# EasyEDA schematic 1-Schematic_charger.json
TITLE: Sheet_1; REV: 1.0; Date: 2021-10-08; Sheet: 1/1; Drawn By: Amith bhat D; Company: Your Company
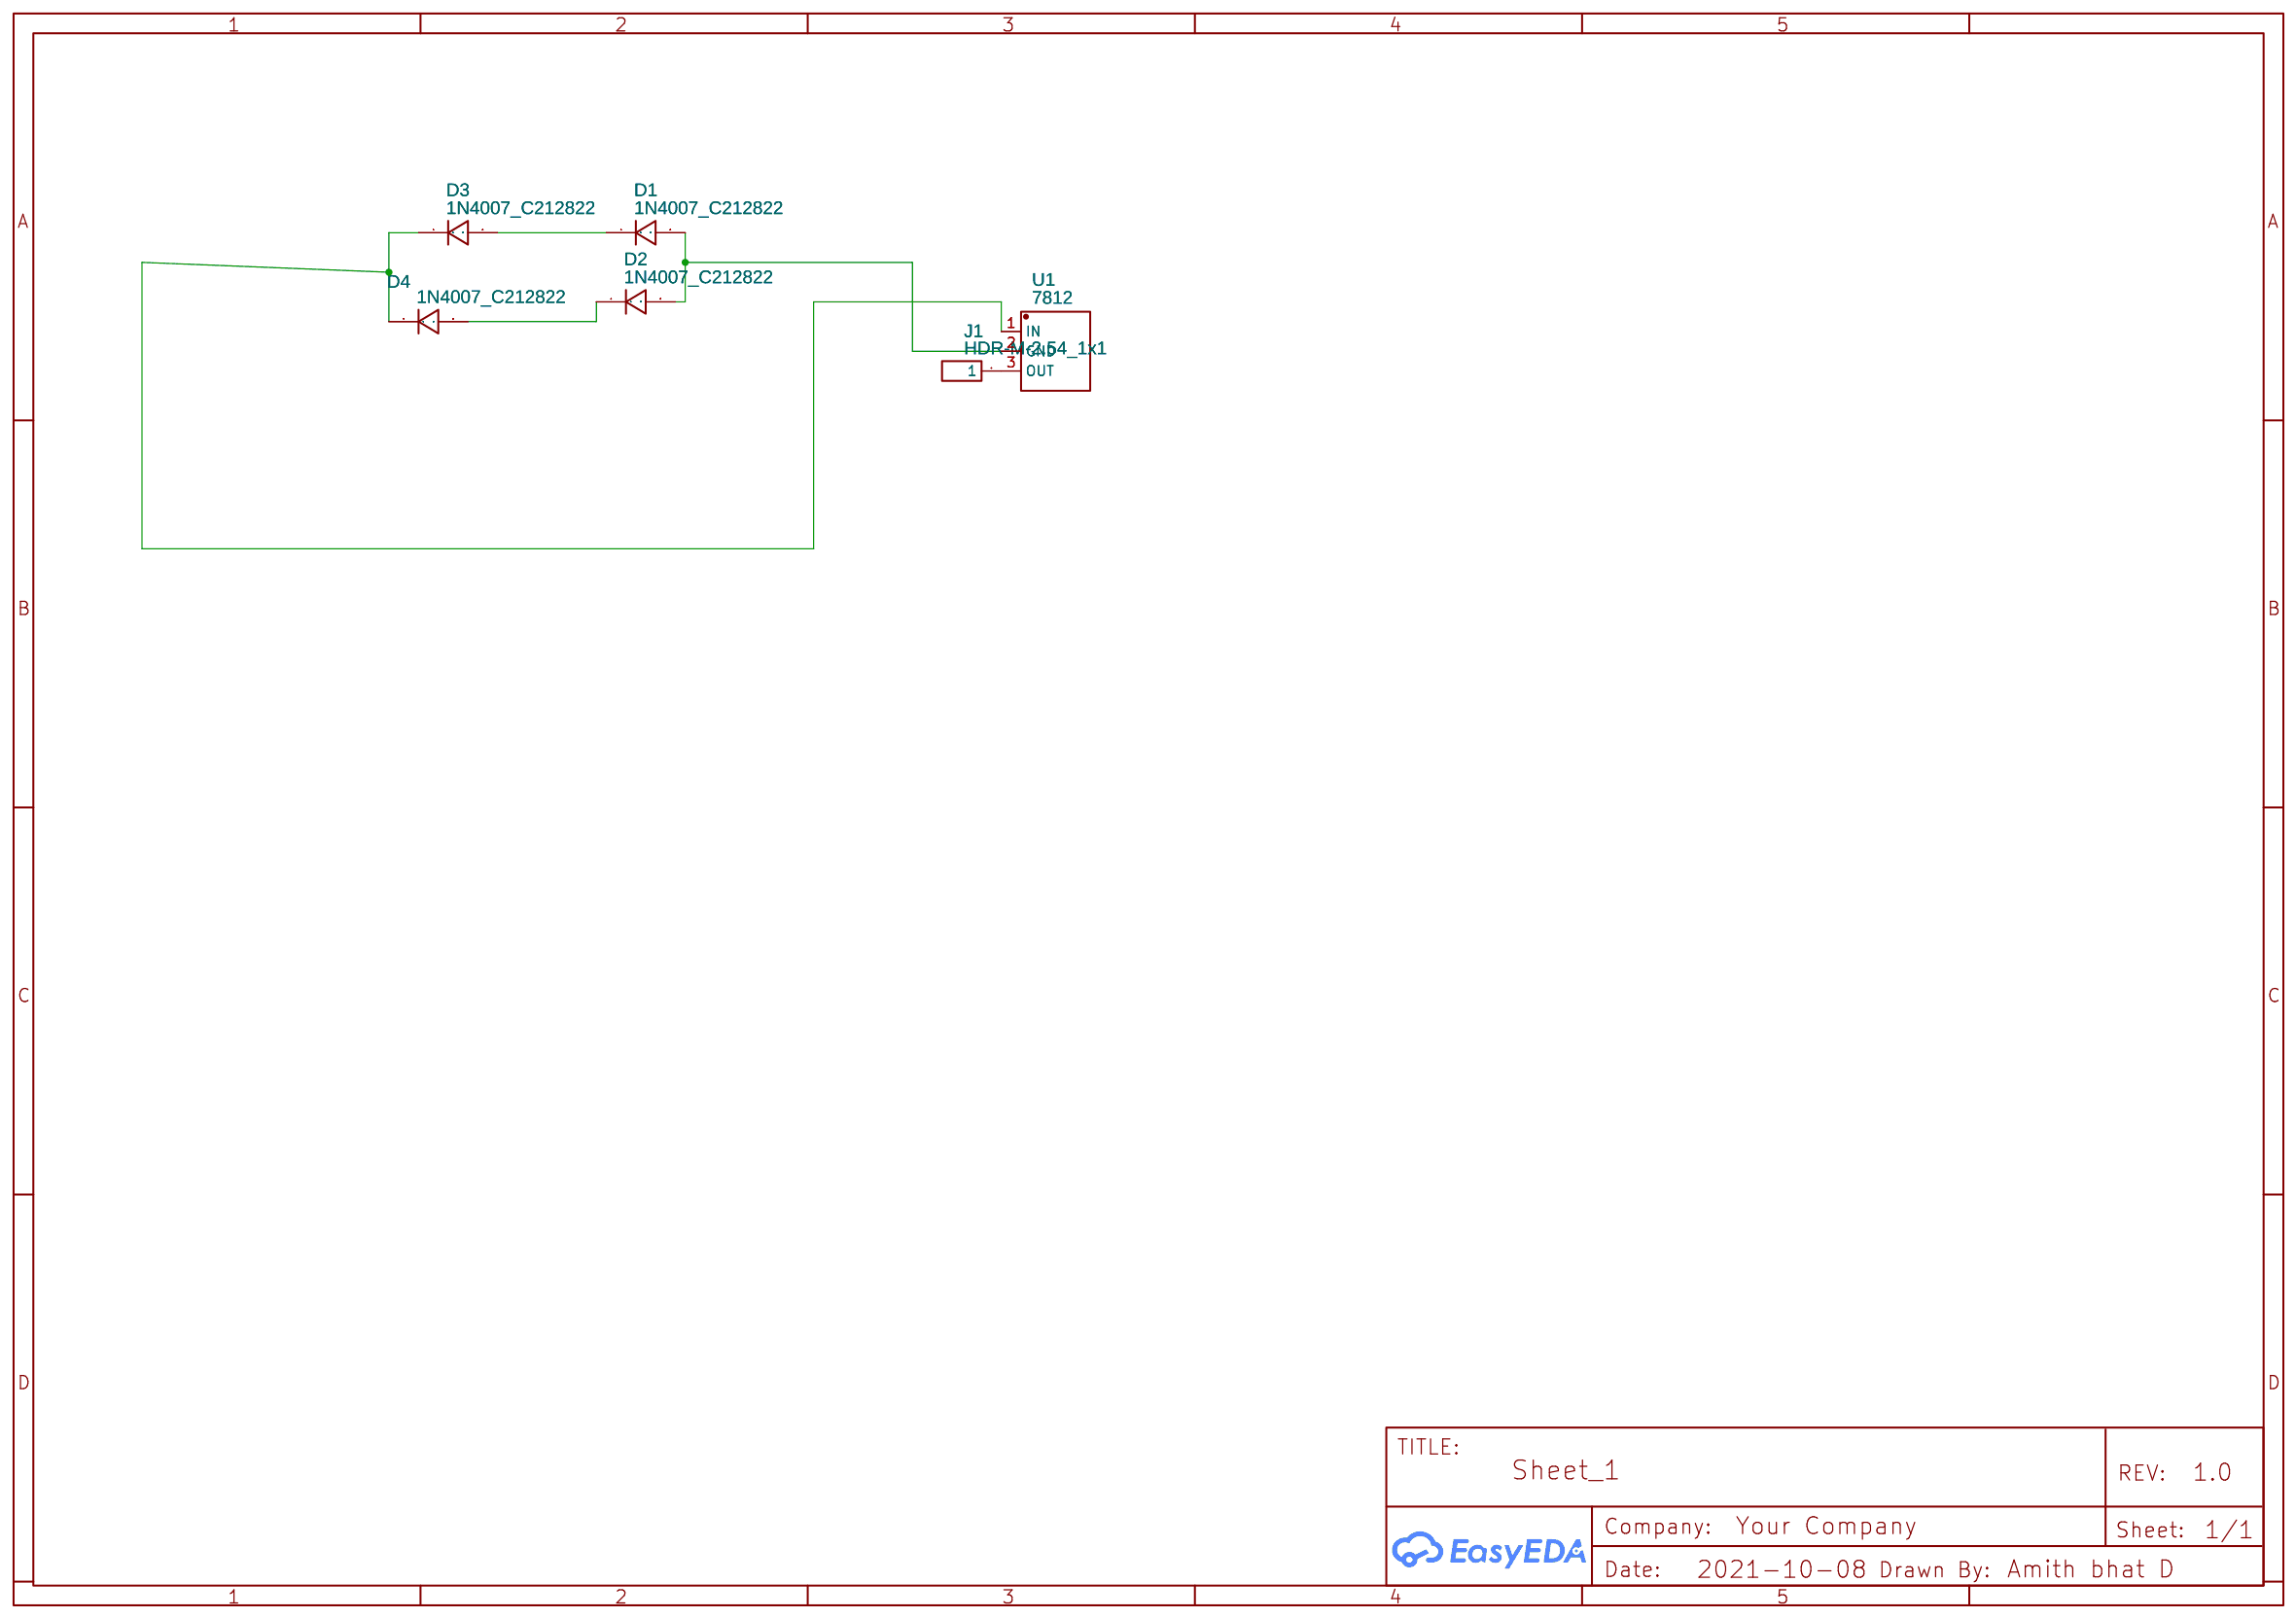
[diagram p0: schematic sheet]

## Parts
D1  1N4007_C212822  [DO-41_BD2.4-L4.7-P8.70-D0.9-RD]
D2  1N4007_C212822  [DO-41_BD2.4-L4.7-P8.70-D0.9-RD]
D3  1N4007_C212822  [DO-41_BD2.4-L4.7-P8.70-D0.9-RD]
D4  1N4007_C212822  [DO-41_BD2.4-L4.7-P8.70-D0.9-RD]
J1  HDR-M-2.54_1x1  [HDR-M-2.54_1X1]
U1  7812  [TO-220-3_L10.0-W4.5-P2.54-L]

## Library data of the parts
D1-D4 = 1N4007_C212822: Supplier: LCSC; Supplier Part: C212822; Manufacturer: (DIOTEC); Manufacturer Part: 1N4007; Contributor: LCSC; JLCPCB Part Class: Extended Part
J1 = HDR-M-2.54_1x1: Supplier Part: C81276; Supplier: LCSC; Contributor: LCEDA_Lib
U1 = 7812: Supplier: LCSC; Supplier Part: C358369; Manufacturer: Foshan Blue Rocket Elec; Contributor: LCSC; JLCPCB Part Class: Extended Part

## Nets
Net-(D1-1): D1.1 D3.2
Net-(D1-2): D1.2 D2.2 U1.2(GND)
Net-(D2-1): D2.1 D4.2
Net-(D3-1): D3.1 D4.1 U1.1(IN)
Net-(J1-1): J1.1 U1.3(OUT)
